# EAGLE schematic Main Board (EAGLE 9.6.2)
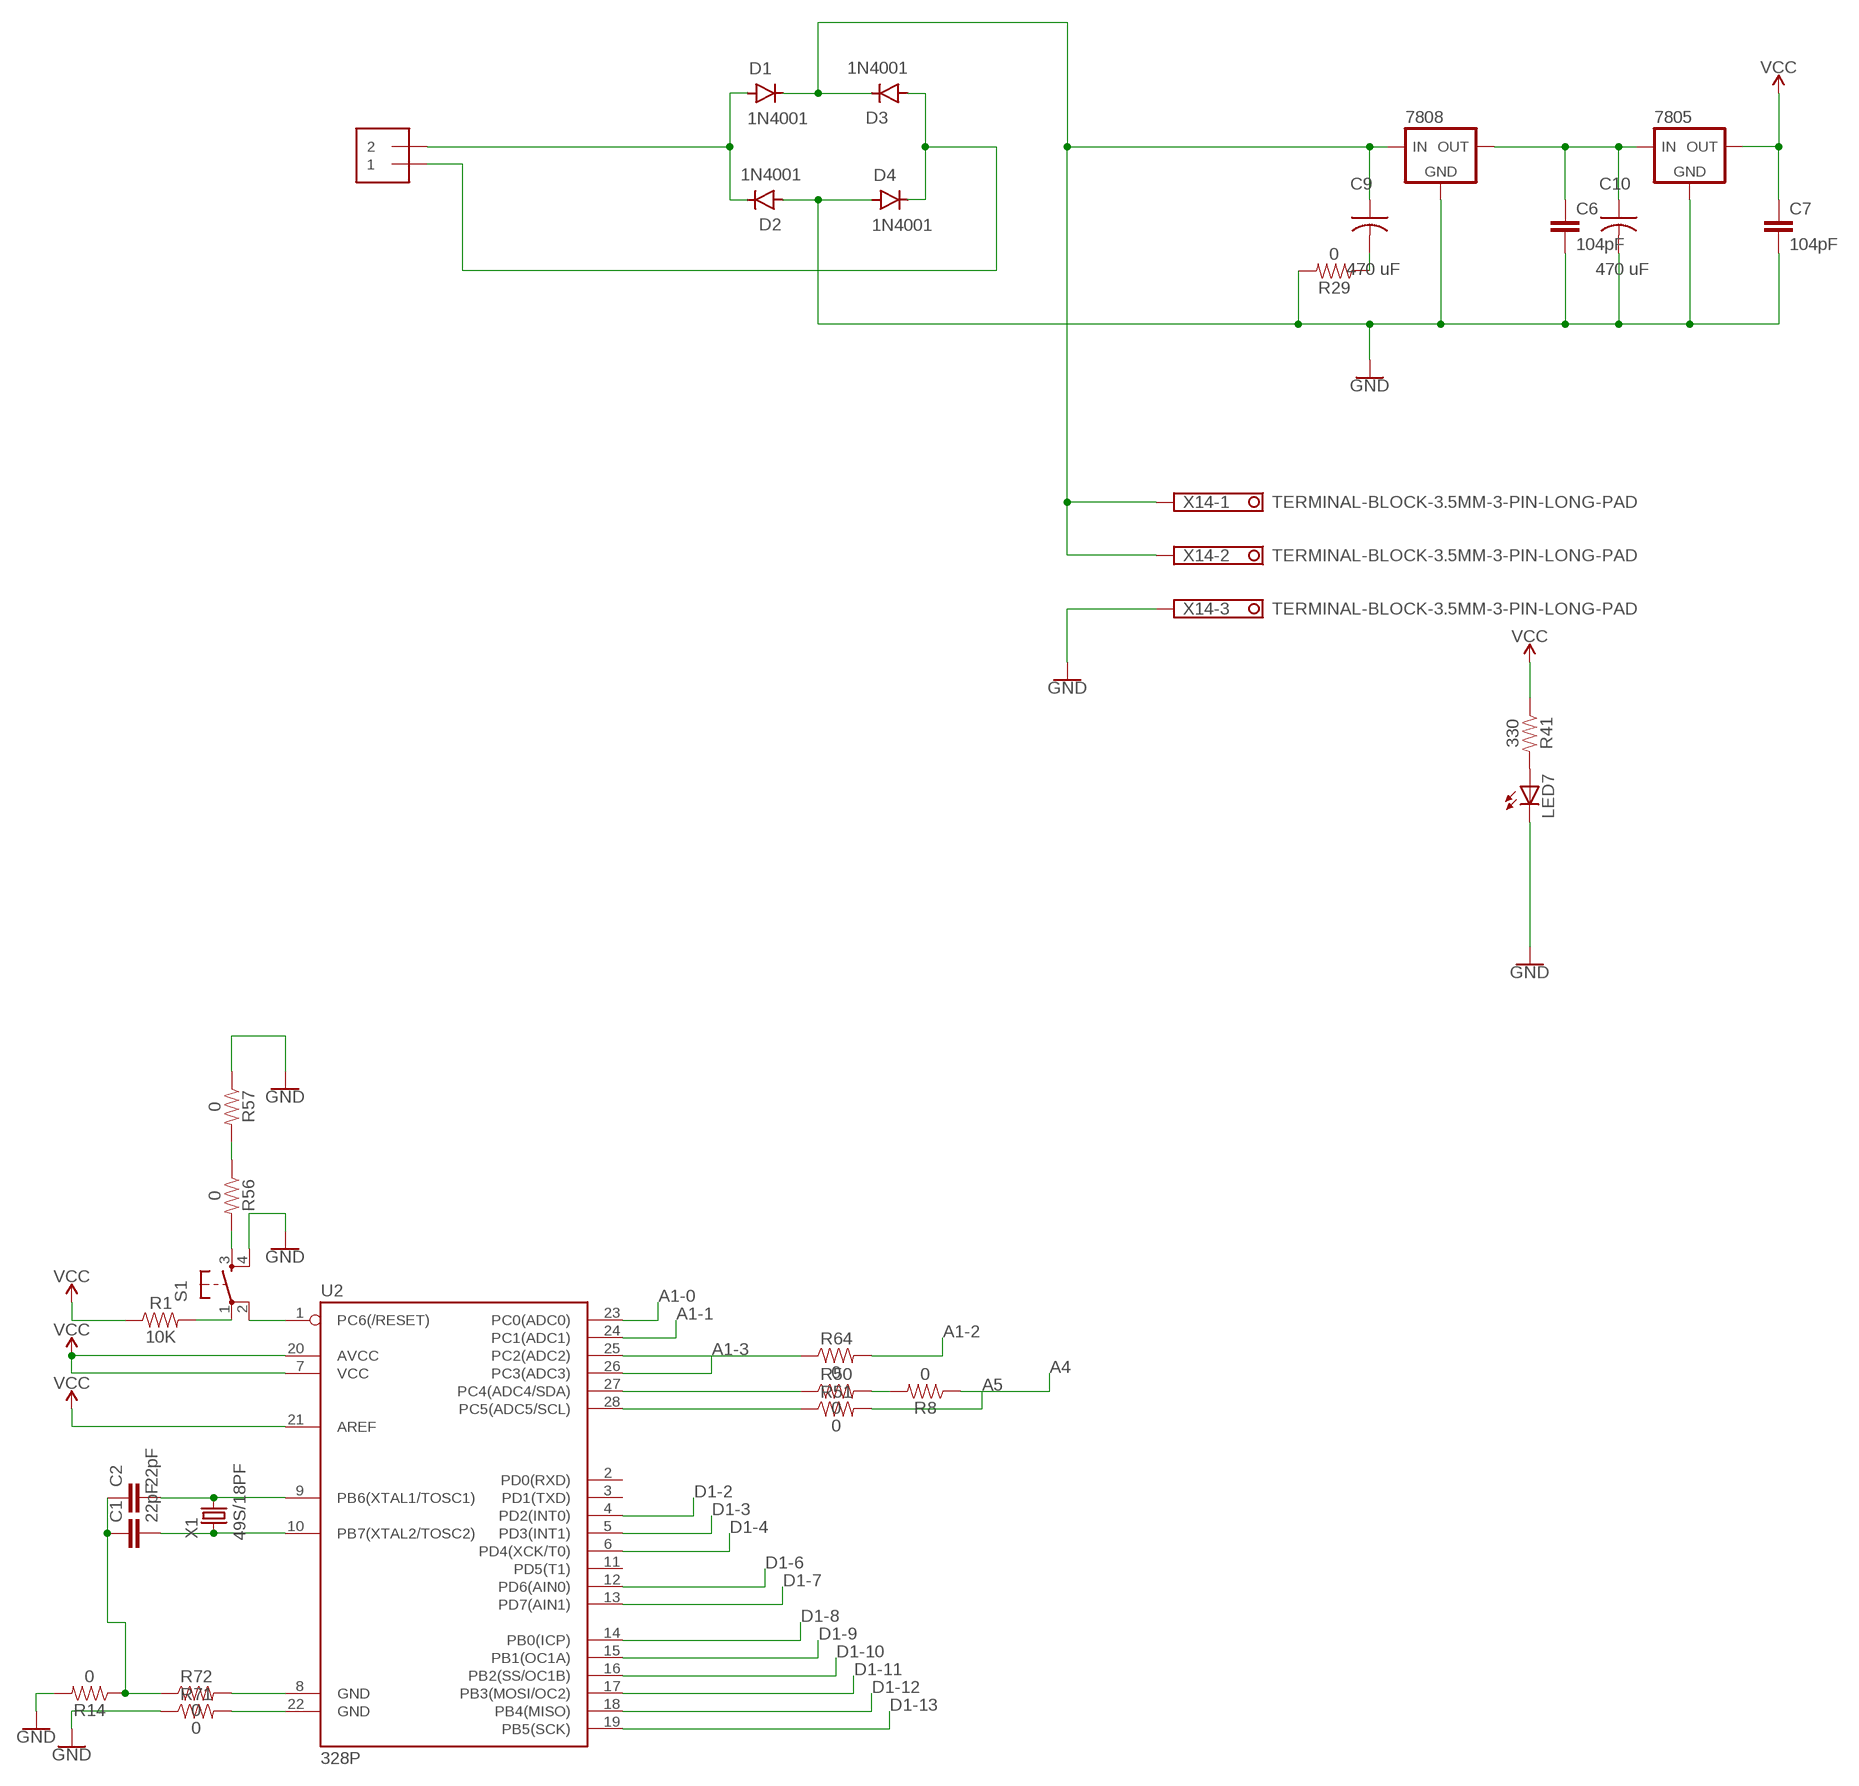
[diagram p0: schematic, sheet 1, part 1 of 3]
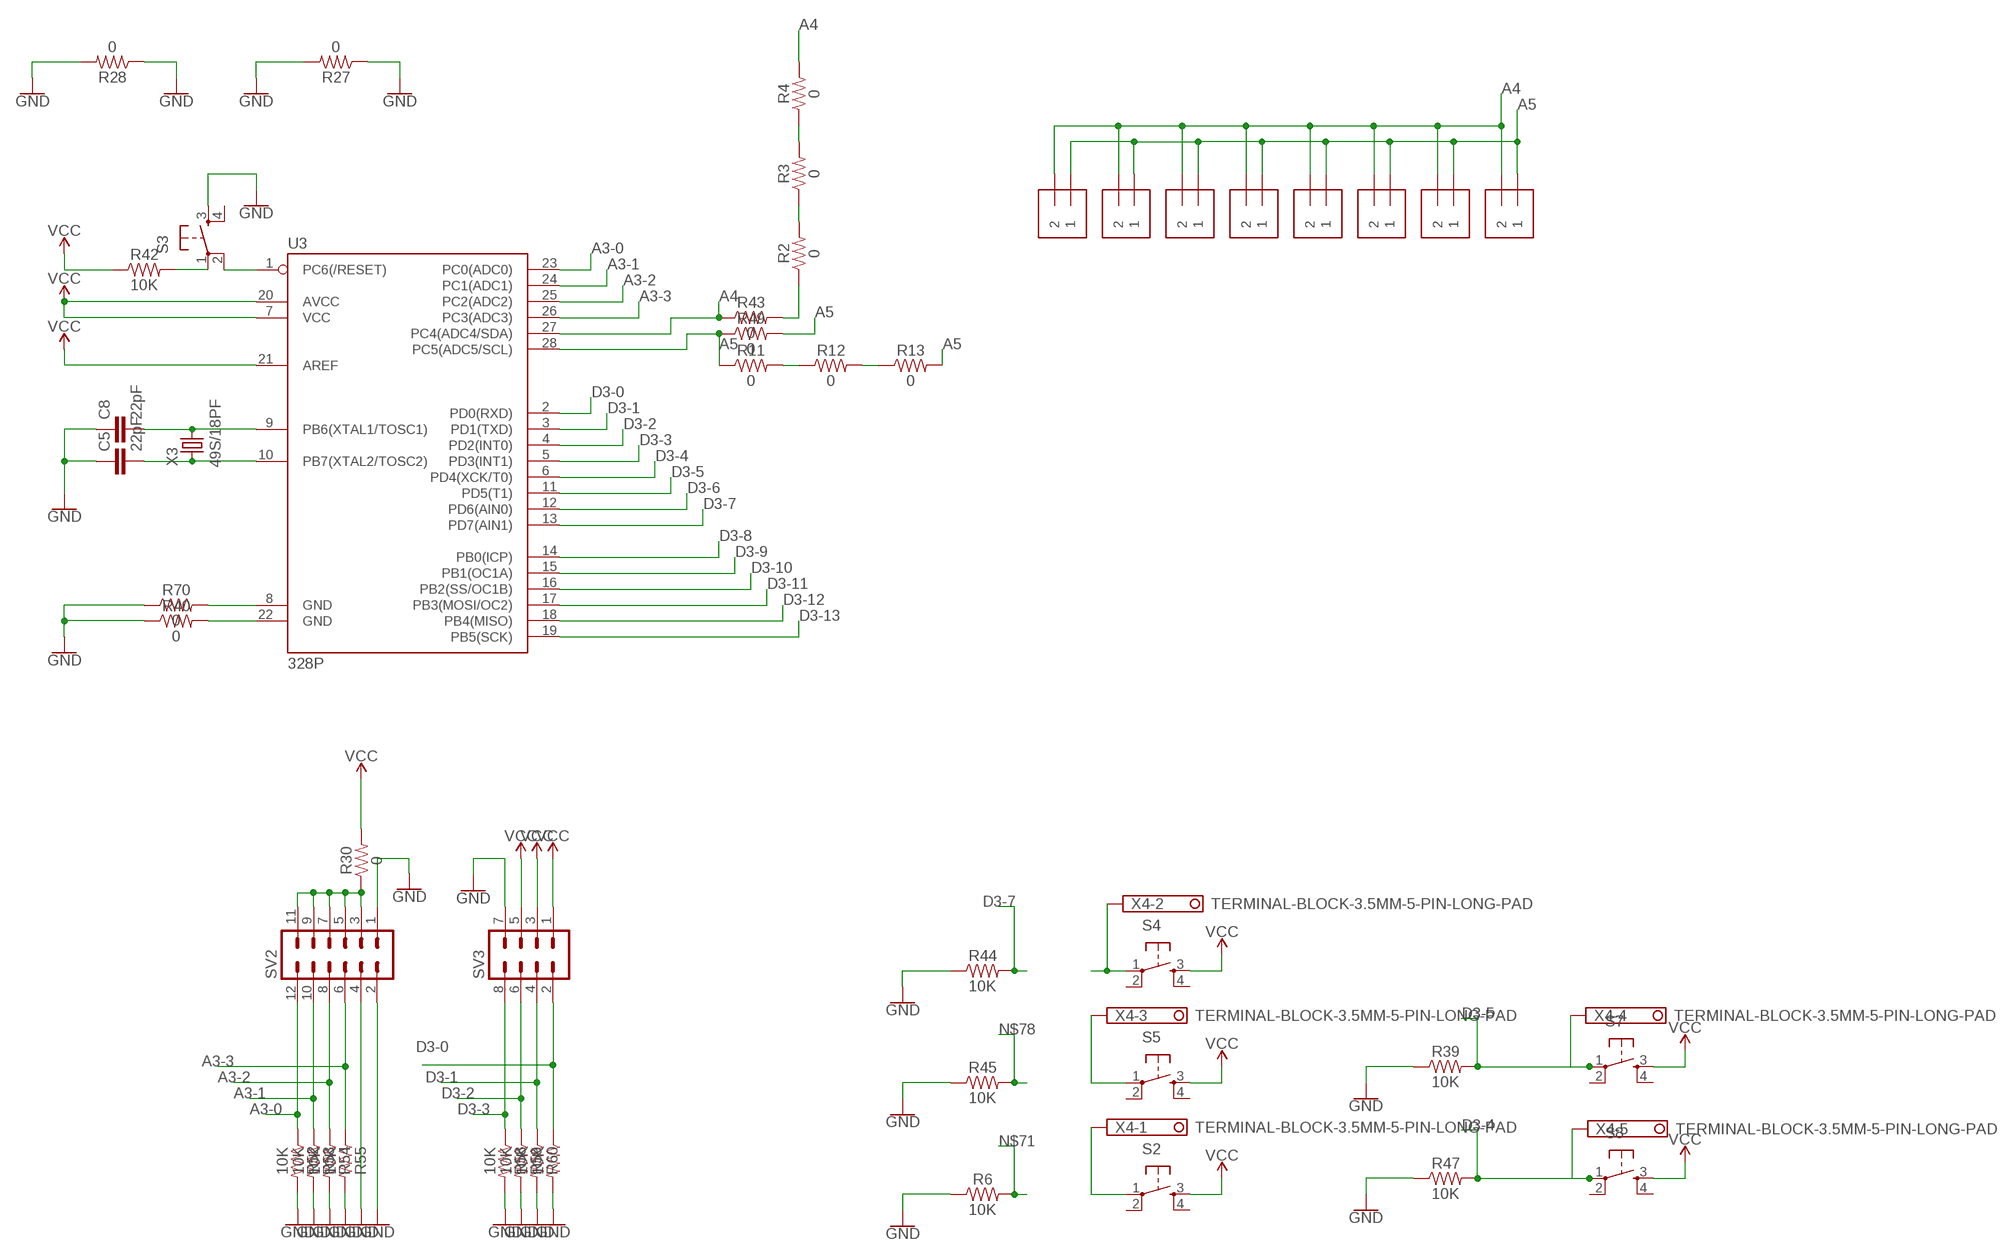
[diagram p1: schematic, sheet 1, part 2 of 3]
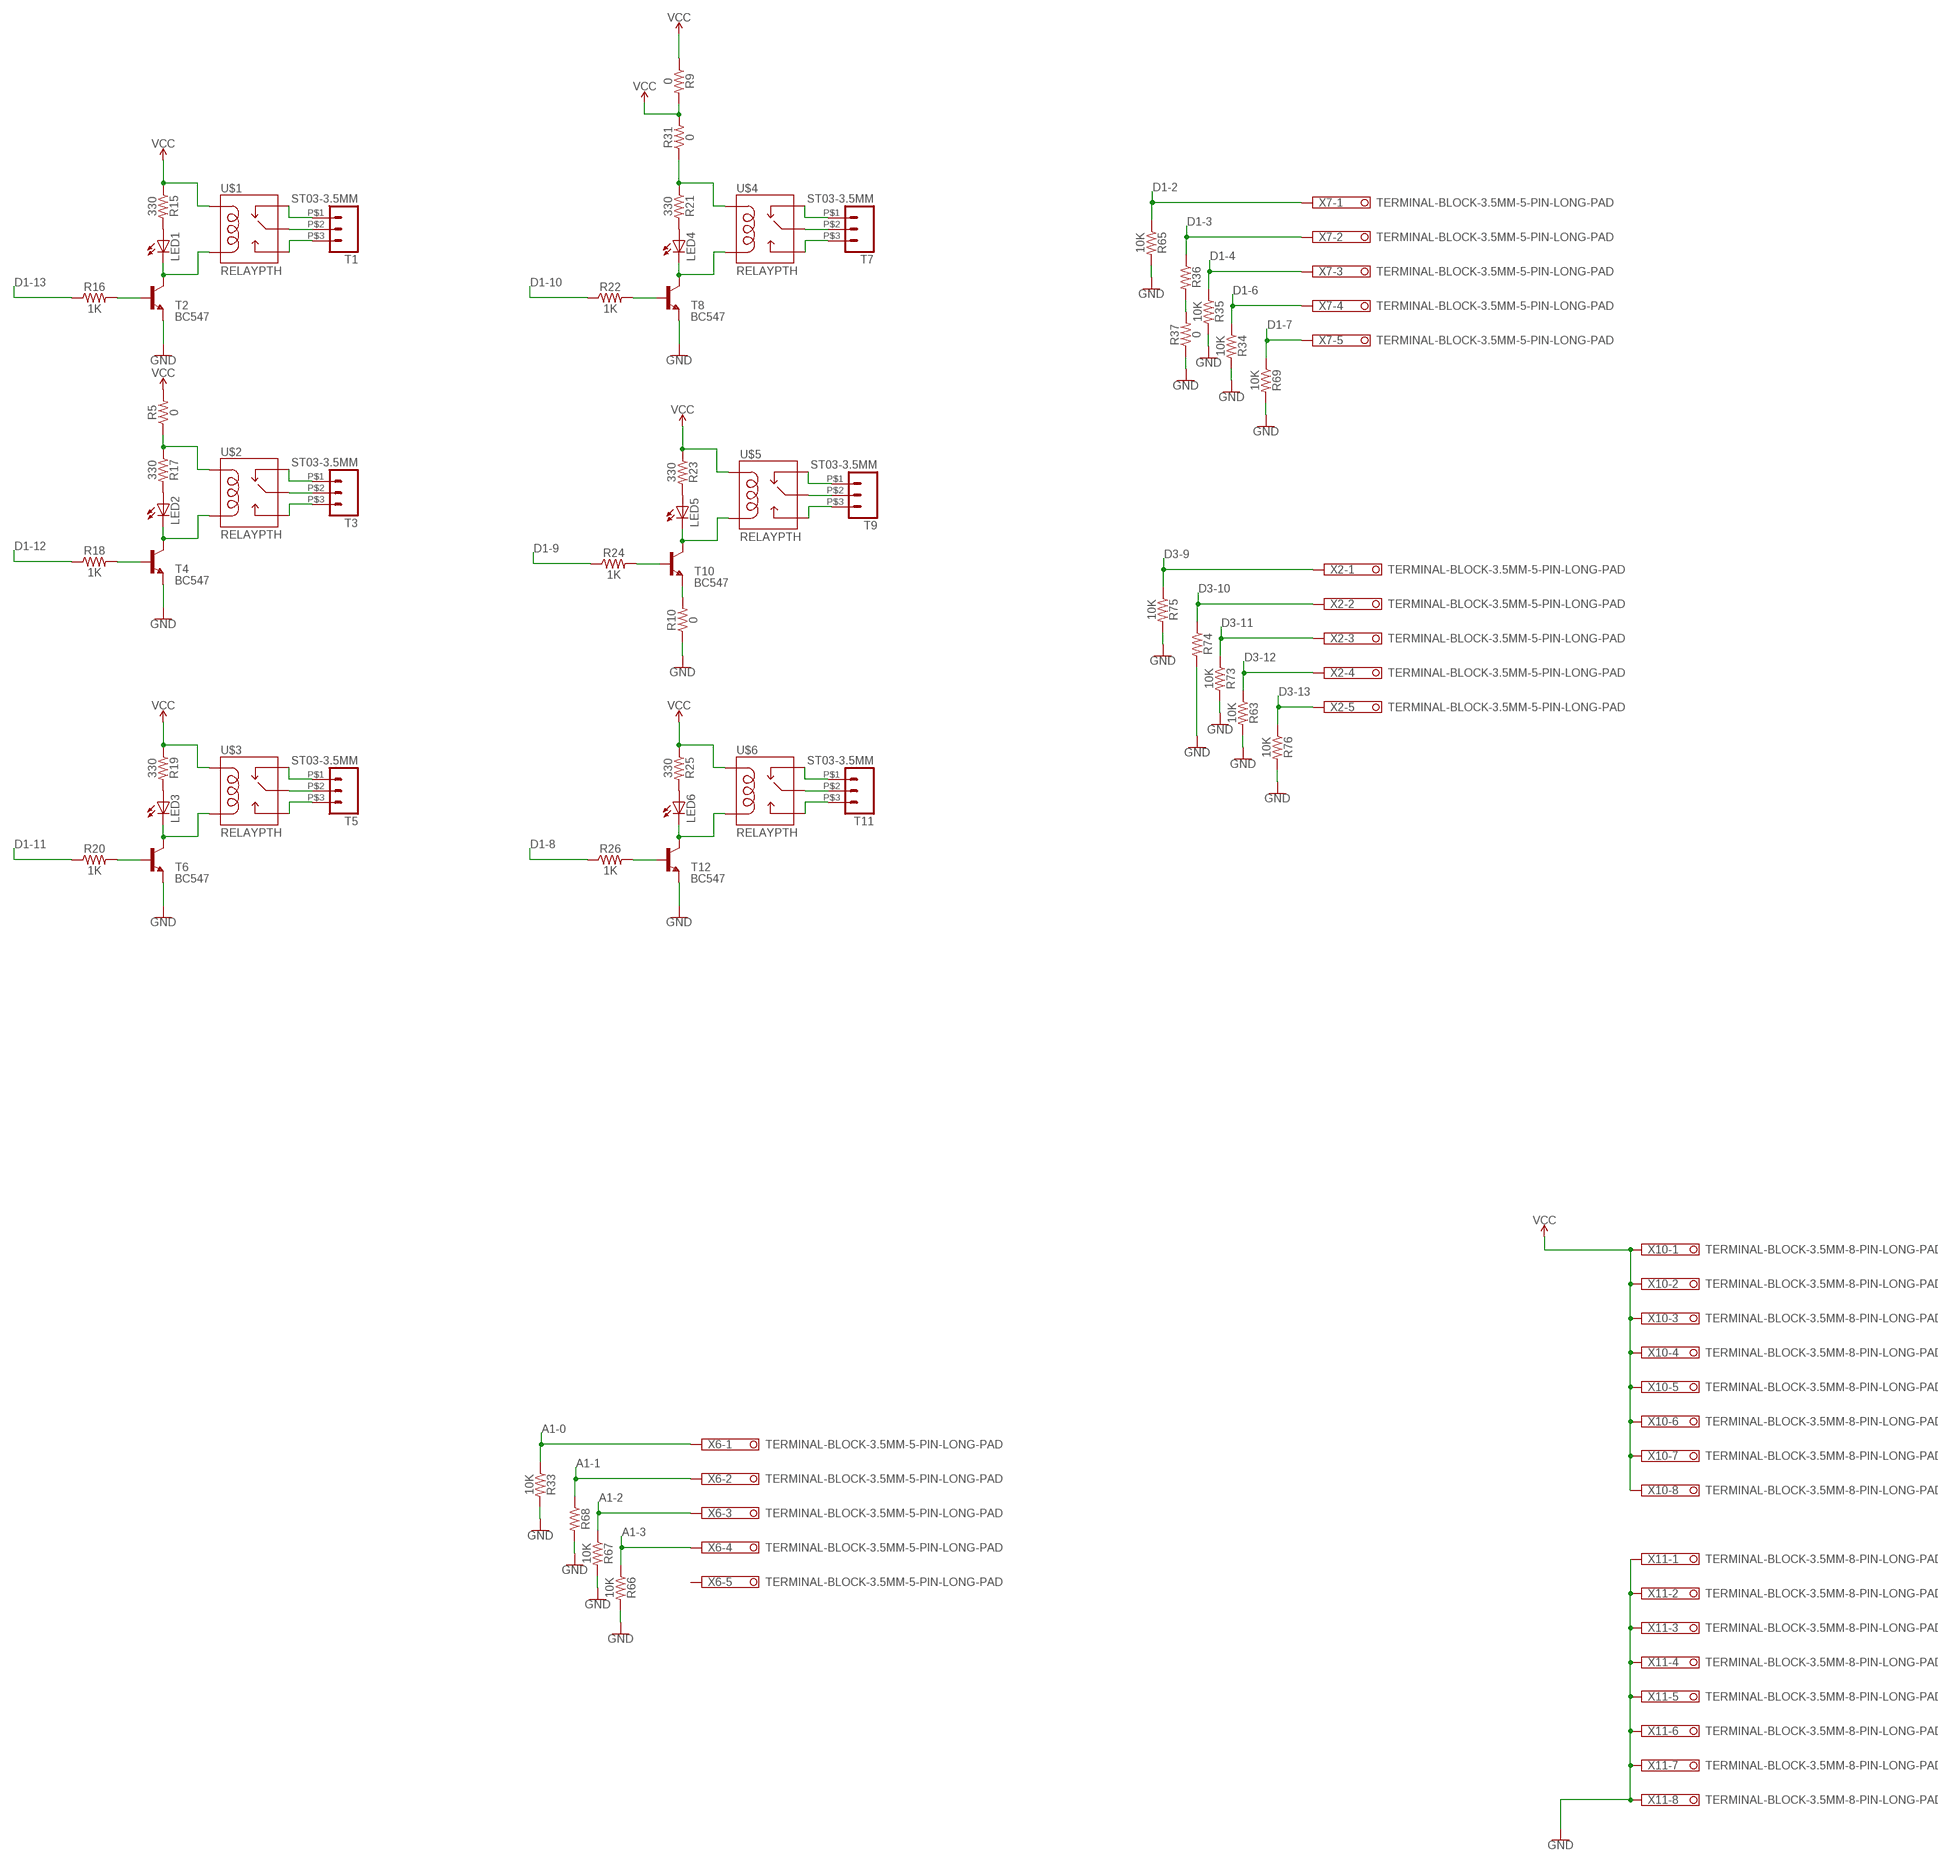
[diagram p2: schematic, sheet 1, part 3 of 3]

## Parts
7805  78XX-TO220H-NH  [TO220BH-NH]
7808  78XX-TO220H-NH  [TO220BH-NH]
C1  22pF  22PF-PTH-2.54MM-200V-5%  [CAP-PTH-2.54]
C2  22pF  22PF-PTH-2.54MM-200V-5%  [CAP-PTH-2.54]
C5  22pF  22PF-PTH-2.54MM-200V-5%  [CAP-PTH-2.54]
C6  104pF  22PF-PTH-2.54MM-200V-5%  [CAP-PTH-2.54]
C7  104pF  22PF-PTH-2.54MM-200V-5%  [CAP-PTH-2.54]
C8  22pF  22PF-PTH-2.54MM-200V-5%  [CAP-PTH-2.54]
C9  470 uF  ECA-1EM102  [CAP_RADIAL_5MM]
C10  470 uF  ECA-1EM102  [CAP_RADIAL_5MM]
D1  1N4001  1N4004  [DO-41]
D2  1N4001  1N4004  [DO-41]
D3  1N4001  1N4004  [DO-41]
D4  1N4001  1N4004  [DO-41]
LED1  LED5MM  [LED5MM]
LED2  LED5MM  [LED5MM]
LED3  LED5MM  [LED5MM]
LED4  LED5MM  [LED5MM]
LED5  LED5MM  [LED5MM]
LED6  LED5MM  [LED5MM]
LED7  LED5MM  [LED5MM]
POWER-INPUT  1X2-3.5MM  [1X2-3.5MM]
POWER-INPUT1  1X2-3.5MM  [1X2-3.5MM]
POWER-INPUT2  1X2-3.5MM  [1X2-3.5MM]
POWER-INPUT3  1X2-3.5MM  [1X2-3.5MM]
POWER-INPUT4  1X2-3.5MM  [1X2-3.5MM]
POWER-INPUT5  1X2-3.5MM  [1X2-3.5MM]
POWER-INPUT6  1X2-3.5MM  [1X2-3.5MM]
POWER-INPUT7  1X2-3.5MM  [1X2-3.5MM]
POWER-INPUT8  1X2-3.5MM  [1X2-3.5MM]
R1  10K  10MOHM-HORIZ-1/4W-5%  [AXIAL-0.3]
R2  0  10MOHM-HORIZ-1/4W-5%  [AXIAL-0.3]
R3  0  10MOHM-HORIZ-1/4W-5%  [AXIAL-0.3]
R4  0  10MOHM-HORIZ-1/4W-5%  [AXIAL-0.3]
R5  0  10MOHM-HORIZ-1/4W-5%  [AXIAL-0.3]
R6  10K  10MOHM-HORIZ-1/4W-5%  [AXIAL-0.3]
R8  0  10MOHM-HORIZ-1/4W-5%  [AXIAL-0.3]
R9  0  10MOHM-HORIZ-1/4W-5%  [AXIAL-0.3]
R10  0  10MOHM-HORIZ-1/4W-5%  [AXIAL-0.3]
R11  0  10MOHM-HORIZ-1/4W-5%  [AXIAL-0.3]
R12  0  10MOHM-HORIZ-1/4W-5%  [AXIAL-0.3]
R13  0  10MOHM-HORIZ-1/4W-5%  [AXIAL-0.3]
R14  0  10MOHM-HORIZ-1/4W-5%  [AXIAL-0.3]
R15  330  10MOHM-HORIZ-1/4W-5%  [AXIAL-0.3]
R16  1K  10MOHM-HORIZ-1/4W-5%  [AXIAL-0.3]
R17  330  10MOHM-HORIZ-1/4W-5%  [AXIAL-0.3]
R18  1K  10MOHM-HORIZ-1/4W-5%  [AXIAL-0.3]
R19  330  10MOHM-HORIZ-1/4W-5%  [AXIAL-0.3]
R20  1K  10MOHM-HORIZ-1/4W-5%  [AXIAL-0.3]
R21  330  10MOHM-HORIZ-1/4W-5%  [AXIAL-0.3]
R22  1K  10MOHM-HORIZ-1/4W-5%  [AXIAL-0.3]
R23  330  10MOHM-HORIZ-1/4W-5%  [AXIAL-0.3]
R24  1K  10MOHM-HORIZ-1/4W-5%  [AXIAL-0.3]
R25  330  10MOHM-HORIZ-1/4W-5%  [AXIAL-0.3]
R26  1K  10MOHM-HORIZ-1/4W-5%  [AXIAL-0.3]
R27  0  10MOHM-HORIZ-1/4W-5%  [AXIAL-0.3]
R28  0  10MOHM-HORIZ-1/4W-5%  [AXIAL-0.3]
R29  0  10MOHM-HORIZ-1/4W-5%  [AXIAL-0.3]
R30  0  10MOHM-HORIZ-1/4W-5%  [AXIAL-0.3]
R31  0  10MOHM-HORIZ-1/4W-5%  [AXIAL-0.3]
R33  10K  10MOHM-HORIZ-1/4W-5%  [AXIAL-0.3]
R34  10K  10MOHM-HORIZ-1/4W-5%  [AXIAL-0.3]
R35  10K  10MOHM-HORIZ-1/4W-5%  [AXIAL-0.3]
R36  10K  10MOHM-HORIZ-1/4W-5%  [AXIAL-0.3]
R37  0  10MOHM-HORIZ-1/4W-5%  [AXIAL-0.3]
R39  10K  10MOHM-HORIZ-1/4W-5%  [AXIAL-0.3]
R40  0  10MOHM-HORIZ-1/4W-5%  [AXIAL-0.3]
R41  330  10MOHM-HORIZ-1/4W-5%  [AXIAL-0.3]
R42  10K  10MOHM-HORIZ-1/4W-5%  [AXIAL-0.3]
R43  0  10MOHM-HORIZ-1/4W-5%  [AXIAL-0.3]
R44  10K  10MOHM-HORIZ-1/4W-5%  [AXIAL-0.3]
R45  10K  10MOHM-HORIZ-1/4W-5%  [AXIAL-0.3]
R47  10K  10MOHM-HORIZ-1/4W-5%  [AXIAL-0.3]
R49  0  10MOHM-HORIZ-1/4W-5%  [AXIAL-0.3]
R50  0  10MOHM-HORIZ-1/4W-5%  [AXIAL-0.3]
R51  0  10MOHM-HORIZ-1/4W-5%  [AXIAL-0.3]
R52  10K  10MOHM-HORIZ-1/4W-5%  [AXIAL-0.3]
R53  10K  10MOHM-HORIZ-1/4W-5%  [AXIAL-0.3]
R54  10K  10MOHM-HORIZ-1/4W-5%  [AXIAL-0.3]
R55  10K  10MOHM-HORIZ-1/4W-5%  [AXIAL-0.3]
R56  0  10MOHM-HORIZ-1/4W-5%  [AXIAL-0.3]
R57  0  10MOHM-HORIZ-1/4W-5%  [AXIAL-0.3]
R58  10K  10MOHM-HORIZ-1/4W-5%  [AXIAL-0.3]
R59  10K  10MOHM-HORIZ-1/4W-5%  [AXIAL-0.3]
R60  10K  10MOHM-HORIZ-1/4W-5%  [AXIAL-0.3]
R61  10K  10MOHM-HORIZ-1/4W-5%  [AXIAL-0.3]
R63  10K  10MOHM-HORIZ-1/4W-5%  [AXIAL-0.3]
R64  0  10MOHM-HORIZ-1/4W-5%  [AXIAL-0.3]
R65  10K  10MOHM-HORIZ-1/4W-5%  [AXIAL-0.3]
R66  10K  10MOHM-HORIZ-1/4W-5%  [AXIAL-0.3]
R67  10K  10MOHM-HORIZ-1/4W-5%  [AXIAL-0.3]
R68  10K  10MOHM-HORIZ-1/4W-5%  [AXIAL-0.3]
R69  10K  10MOHM-HORIZ-1/4W-5%  [AXIAL-0.3]
R70  0  10MOHM-HORIZ-1/4W-5%  [AXIAL-0.3]
R71  0  10MOHM-HORIZ-1/4W-5%  [AXIAL-0.3]
R72  0  10MOHM-HORIZ-1/4W-5%  [AXIAL-0.3]
R73  10K  10MOHM-HORIZ-1/4W-5%  [AXIAL-0.3]
R74  10K  10MOHM-HORIZ-1/4W-5%  [AXIAL-0.3]
R75  10K  10MOHM-HORIZ-1/4W-5%  [AXIAL-0.3]
R76  10K  10MOHM-HORIZ-1/4W-5%  [AXIAL-0.3]
S1  TAC_SWITCHPTH  [TACTILE-PTH]
S2  TAC_SWITCHPTH  [TACTILE-PTH]
S3  TAC_SWITCHPTH  [TACTILE-PTH]
S4  TAC_SWITCHPTH  [TACTILE-PTH]
S5  TAC_SWITCHPTH  [TACTILE-PTH]
S7  TAC_SWITCHPTH  [TACTILE-PTH]
S8  TAC_SWITCHPTH  [TACTILE-PTH]
SV2  MA06-2  [MA06-2]
SV3  MA04-2  [MA04-2]
T1  ST03-3.5MM  [ED350V-03P]
T2  BC547  [TO92]
T3  ST03-3.5MM  [ED350V-03P]
T4  BC547  [TO92]
T5  ST03-3.5MM  [ED350V-03P]
T6  BC547  [TO92]
T7  ST03-3.5MM  [ED350V-03P]
T8  BC547  [TO92]
T9  ST03-3.5MM  [ED350V-03P]
T10  BC547  [TO92]
T11  ST03-3.5MM  [ED350V-03P]
T12  BC547  [TO92]
U2  328P  ATMEGA328P_PDIP  [DIP28]
U3  328P  ATMEGA328P_PDIP  [DIP28]
U$1  RELAYPTH  [SRD-05VDC-SL-C]
U$2  RELAYPTH  [SRD-05VDC-SL-C]
U$3  RELAYPTH  [SRD-05VDC-SL-C]
U$4  RELAYPTH  [SRD-05VDC-SL-C]
U$5  RELAYPTH  [SRD-05VDC-SL-C]
U$6  RELAYPTH  [SRD-05VDC-SL-C]
X1  49S/18PF  [XTAL_HC49]
X2  TERMINAL-BLOCK-3.5MM-5-PIN-LONG-PAD  [TERMINAL-BLOCK-5-PIN-3.5MM-LONG-PAD]
X3  49S/18PF  [XTAL_HC49]
X4  TERMINAL-BLOCK-3.5MM-5-PIN-LONG-PAD  [TERMINAL-BLOCK-5-PIN-3.5MM-LONG-PAD]
X6  TERMINAL-BLOCK-3.5MM-5-PIN-LONG-PAD  [TERMINAL-BLOCK-5-PIN-3.5MM-LONG-PAD]
X7  TERMINAL-BLOCK-3.5MM-5-PIN-LONG-PAD  [TERMINAL-BLOCK-5-PIN-3.5MM-LONG-PAD]
X10  TERMINAL-BLOCK-3.5MM-8-PIN-LONG-PAD  [TERMINAL-BLOCK-8-PIN-3.5MM-LONG-PAD]
X11  TERMINAL-BLOCK-3.5MM-8-PIN-LONG-PAD  [TERMINAL-BLOCK-8-PIN-3.5MM-LONG-PAD]
X14  TERMINAL-BLOCK-3.5MM-3-PIN-LONG-PAD  [TERMINAL-BLOCK-3-PIN-3.5MM-LONG-PAD]

## Nets
A1-0: R33.P$1 U2.23(PC0(ADC0)) X6.1
A1-1: R68.P$1 U2.24(PC1(ADC1)) X6.2
A1-2: R64.P$2 R67.P$1 X6.3
A1-3: R66.P$1 U2.26(PC3(ADC3)) X6.4
A3-0: R52.P$1 SV2.12 U3.23(PC0(ADC0))
A3-1: R53.P$1 SV2.10 U3.24(PC1(ADC1))
A3-2: R54.P$1 SV2.8 U3.25(PC2(ADC2))
A3-3: R55.P$1 SV2.6 U3.26(PC3(ADC3))
A4: POWER-INPUT1.2 POWER-INPUT2.2 POWER-INPUT3.2 POWER-INPUT4.2 POWER-INPUT5.2 POWER-INPUT6.2 POWER-INPUT7.2 POWER-INPUT8.2 R4.P$2 R8.P$1 R43.P$1 U3.27(PC4(ADC4/SDA))
A5: POWER-INPUT1.1 POWER-INPUT2.1 POWER-INPUT3.1 POWER-INPUT4.1 POWER-INPUT5.1 POWER-INPUT6.1 POWER-INPUT7.1 POWER-INPUT8.1 R11.P$1 R13.P$2 R49.P$1 R49.P$2 R51.P$2 U3.28(PC5(ADC5/SCL))
D1-2: R65.P$1 U2.4(PD2(INT0)) X7.1
D1-3: R36.P$1 U2.5(PD3(INT1)) X7.2
D1-4: R35.P$1 U2.6(PD4(XCK/T0)) X7.3
D1-6: R34.P$1 U2.12(PD6(AIN0)) X7.4
D1-7: R69.P$1 U2.13(PD7(AIN1)) X7.5
D1-8: R26.P$1 U2.14(PB0(ICP))
D1-9: R24.P$1 U2.15(PB1(OC1A))
D1-10: R22.P$1 U2.16(PB2(SS/OC1B))
D1-11: R20.P$1 U2.17(PB3(MOSI/OC2))
D1-12: R18.P$1 U2.18(PB4(MISO))
D1-13: R16.P$1 U2.19(PB5(SCK))
D3-0: R61.P$1 SV3.2 U3.2(PD0(RXD))
D3-1: R60.P$1 SV3.4 U3.3(PD1(TXD))
D3-2: R59.P$1 SV3.6 U3.4(PD2(INT0))
D3-3: R58.P$1 SV3.8 U3.5(PD3(INT1))
D3-4: R47.P$2 S8.1 U3.6(PD4(XCK/T0)) X4.5
D3-5: R39.P$2 S7.1 U3.11(PD5(T1)) X4.4
D3-6: S5.1 U3.12(PD6(AIN0)) X4.3
D3-7: R44.P$2 U3.13(PD7(AIN1))
D3-8: S2.1 U3.14(PB0(ICP)) X4.1
D3-9: R75.P$1 U3.15(PB1(OC1A)) X2.1
D3-10: R74.P$1 U3.16(PB2(SS/OC1B)) X2.2
D3-11: R73.P$1 U3.17(PB3(MOSI/OC2)) X2.3
D3-12: R63.P$1 U3.18(PB4(MISO)) X2.4
D3-13: R76.P$1 U3.19(PB5(SCK)) X2.5
GND: 7805.2(GND) 7808.2(GND) C5.1 C6.2 C7.2 C8.1 C10.2 D2.A D4.A LED7.K(C) R6.P$1 R10.P$1 R14.P$2 R27.P$1 R27.P$2 R28.P$1 R28.P$2 R29.P$2 R33.P$2 R34.P$2 R35.P$2 R37.P$1 R39.P$1 R40.P$1 R44.P$1 R45.P$1 R47.P$1 R52.P$2 R53.P$2 R54.P$2 R55.P$2 R57.P$1 R58.P$2 R59.P$2 R60.P$2 R61.P$2 R63.P$2 R65.P$2 R66.P$2 R67.P$2 R68.P$2 R69.P$2 R70.P$1 R71.P$1 R73.P$2 R74.P$2 R75.P$2 R76.P$2 S1.4 S3.3 SV2.1 SV2.2 SV2.4 SV3.7 T2.1(E) T4.1(E) T6.1(E) T8.1(E) T12.1(E) X11.1 X11.2 X11.3 X11.4 X11.5 X11.6 X11.7 X11.8 X14.3
N$1: C2.2 U2.9(PB6(XTAL1/TOSC1)) X1.2
N$2: C1.2 U2.10(PB7(XTAL2/TOSC2)) X1.1
N$3: R1.P$2 S1.1
N$4: S1.2 U2.1(PC6(/RESET))
N$5: R2.P$1 R43.P$2
N$6: R2.P$2 R3.P$1
N$7: R3.P$2 R4.P$1
N$8: R5.P$1 R17.P$1 U$2.COIL1
N$9: LED1.A R15.P$2
N$10: LED1.K(C) T2.3(C) U$1.COIL0
N$11: R16.P$2 T2.2(B)
N$12: T1.P$2 U$1.SWCOMMON
N$13: T1.P$1 U$1.SWCLOSED(SWCLOSE)
N$14: T1.P$3 U$1.SWOPEN
N$15: LED2.A R17.P$2
N$16: LED2.K(C) T4.3(C) U$2.COIL0
N$17: R18.P$2 T4.2(B)
N$18: T3.P$2 U$2.SWCOMMON
N$19: T3.P$1 U$2.SWCLOSED(SWCLOSE)
N$20: T3.P$3 U$2.SWOPEN
N$21: LED3.A R19.P$2
N$22: LED3.K(C) T6.3(C) U$3.COIL0
N$23: R20.P$2 T6.2(B)
N$24: T5.P$2 U$3.SWCOMMON
N$25: T5.P$1 U$3.SWCLOSED(SWCLOSE)
N$26: T5.P$3 U$3.SWOPEN
N$27: LED4.A R21.P$2
N$28: LED4.K(C) T8.3(C) U$4.COIL0
N$29: R22.P$2 T8.2(B)
N$30: T7.P$2 U$4.SWCOMMON
N$31: T7.P$1 U$4.SWCLOSED(SWCLOSE)
N$32: T7.P$3 U$4.SWOPEN
N$33: LED5.A R23.P$2
N$34: LED5.K(C) T10.3(C) U$5.COIL0
N$35: R24.P$2 T10.2(B)
N$36: T9.P$2 U$5.SWCOMMON
N$37: T9.P$1 U$5.SWCLOSED(SWCLOSE)
N$38: T9.P$3 U$5.SWOPEN
N$39: LED6.A R25.P$2
N$40: LED6.K(C) T12.3(C) U$6.COIL0
N$41: R26.P$2 T12.2(B)
N$42: T11.P$2 U$6.SWCOMMON
N$43: T11.P$1 U$6.SWCLOSED(SWCLOSE)
N$44: T11.P$3 U$6.SWOPEN
N$45: 7808.1(VIN) C9.1 D1.C D3.C X14.1 X14.2
N$46: LED7.A R41.P$2
N$47: D3.A D4.C POWER-INPUT.1
N$48: D1.A D2.C POWER-INPUT.2
N$49: C8.2 U3.9(PB6(XTAL1/TOSC1)) X3.2
N$50: 7805.1(VIN) 7808.3(VOUT) C6.1 C10.1
N$51: C5.2 U3.10(PB7(XTAL2/TOSC2)) X3.1
N$52: R42.P$2 S3.1
N$53: S3.2 U3.1(PC6(/RESET))
N$54: C9.2 R29.P$1
N$55: C1.1 C2.1 R14.P$1 R72.P$1
N$56: R11.P$2 R12.P$1
N$57: R50.P$1 U2.27(PC4(ADC4/SDA))
N$58: R51.P$1 U2.28(PC5(ADC5/SCL))
N$61: R64.P$1 U2.25(PC2(ADC2))
N$62: R10.P$2 T10.1(E)
N$63: R12.P$2 R13.P$1
N$67: R40.P$2 U3.22(GND)
N$68: R70.P$2 U3.8(GND)
N$69: R71.P$2 U2.22(GND)
N$70: R72.P$2 U2.8(GND)
N$71: R6.P$2
N$72: R8.P$2 R50.P$2
N$73: R30.P$1 SV2.3 SV2.5 SV2.7 SV2.9 SV2.11
N$74: R21.P$1 R31.P$1 U$4.COIL1
N$75: R36.P$2 R37.P$2
N$76: R56.P$2 S1.3
N$77: R56.P$1 R57.P$2
N$78: R45.P$2
N$79: S4.1 X4.2
VCC: 7805.3(VOUT) C7.1 R1.P$1 R5.P$2 R9.P$1 R9.P$2 R15.P$1 R19.P$1 R23.P$1 R25.P$1 R30.P$2 R31.P$2 R41.P$1 R42.P$1 S2.3 S4.3 S5.3 S7.3 S8.3 SV3.1 SV3.3 SV3.5 U2.7(VCC) U2.20(AVCC) U2.21(AREF) U3.7(VCC) U3.20(AVCC) U3.21(AREF) U$1.COIL1 U$3.COIL1 U$5.COIL1 U$6.COIL1 X10.1 X10.2 X10.3 X10.4 X10.5 X10.6 X10.7 X10.8
Unconnected: S2.2 S2.4 S3.4 S4.2 S4.4 S5.2 S5.4 S7.2 S7.4 S8.2 S8.4 U2.2(PD0(RXD)) U2.3(PD1(TXD)) U2.11(PD5(T1)) X6.5

## Library data of the parts
7805 7808 = bt_regulator:78XX: 78XX Linear Voltage Regulator The venerable 7800-series Linear Voltage Regulator, including 7805, 7809, 7812, 7815, 7862 in 5 V, 6.2 V, 8.2 V, 9 V, 12 V, and 15 V, respectively Datasheets TI_LM78L05.pdf <http://www.ti.com/lit/ds/symlink/lm78l05.pdf> Fairchild_LM7805.pdf <https://www.fairchildsemi.com/datasheets/LM/LM7805.pdf>
C1 C2 C5 C8 = SparkFun-Capacitors:22PF: 22pF ceramic capacitors A capacitor is a passive two-terminal electrical component used to store electrical energy temporarily in an electric field.; PROD_ID: CAP-09128
C6 C7 = SparkFun-Capacitors:22PF: 22pF ceramic capacitors A capacitor is a passive two-terminal electrical component used to store electrical energy temporarily in an electric field.; PROD_ID: CAP-09128; VALUE: 22pF
C9 C10 = Resistor_Capacitor:ECA-1EM102: CAP ALUM 1000UF 20% 25V RADIAL Manufacturer's datasheet <https://media.digikey.com/pdf/Data%20Sheets/Panasonic%20Electronic%20Components/ECA-xxM%20Series,TypeA.pdf>; CREATED_BY: PCBLayout.com; DIGIKEY_PART_NUMBER: P5156-ND; MANUFACTURER: Panasonic Electronic Components; MPN: ECA-1EM102; PACKAGE: CAP RADIAL 5MM LS
D1-D4 = Diodes:1N4004: DIODE GEN PURP 400V 1A DO41 Manufacturer's datasheet <https://www.mccsemi.com/pdf/Products/1N4001-1N4007(DO-41).pdf>; CREATED_BY: PCBLayout.com; DIGIKEY_PART_NUMBER: 1N4004MSCT-ND; MANUFACTURER: Micro Commercial Co; MPN: 1N4004; PACKAGE: DO-41
LED1-LED7 = adafruit:LED: LED OSRAM: - CHIPLED LG R971, LG N971, LY N971, LG Q971, LY Q971, LO R971, LY R971 LH N974, LH R974 LS Q976, LO Q976, LY Q976 LO Q996 - Hyper CHIPLED LW Q18S LB Q993, LB Q99A, LB R99A - SideLED LS A670, LO A670, LY A670, LG A670, LP A670 LB A673, LV A673, LT A673, LW A673 LH A674 LY A675 LS A676, LA A676, LO A676, LY A676, LW A676 LS A679, LY A679, LG A679 - Hyper Micro SIDELED® LS Y876, LA Y876, LO Y876, LY Y876 LT Y87S - SmartLED LW L88C, LW L88S LB L89C, LB L89S, LG L890 LS L89K, LO L89K, LY L89K LS L896, LA L896, LO L896, LY L896 - TOPLED LS T670, LO T670, LY T670, LG T670, LP T670 LSG T670, LSP T670, LSY T670, LOP T670, LYG T670 LG T671, LOG T671, LSG T671 LB T673, LV T673, LT T673, LW T673 LH T674 LS T676, LA T676, LO T676, LY T676, LB T676, LH T676, LSB T676, LW T676 LB T67C, LV T67C, LT T67C, LS T67K, LO T67K, LY T67K, LW E67C LS E67B, LA E67B, LO E67B, LY E67B, LB E67C, LV E67C, LT E67C LW T67C LS T679, LY T679, LG T679 LS T770, LO T770, LY T770, LG T770, LP T770 LB T773, LV T773, LT T773, LW T773 LH T774 LS E675, LA E675, LY E675, LS T675 LS T776, LA T776, LO T776, LY T776, LB T776 LHGB T686 LT T68C, LB T68C - Hyper Mini TOPLED® LB M676 - Mini TOPLED Santana® LG M470 LS M47K, LO M47K, LY M47K Source: http://www.osram.convergy.de/
POWER-INPUT POWER-INPUT1-POWER-INPUT8 = adafruit:1X2: 3.5mm Terminal block http://www.ladyada.net/library/pcb/eaglelibrary.html
R1-R6 R8-R31 R33-R37 R39-R45 R47 R49-R61 R63-R76 = SparkFun-Resistors:10MOHM: RES-09327; PROD_ID: RES-09327; VALUE: 10M
S1-S5 S7 S8 = SparkFun:TAC_SWITCH: Momentary Switch Button commonly used for reset or general input. Spark Fun Electronics SKU : COM-00097
SV2 = con-lstb:MA06-2: PIN HEADER; OC_FARNELL: unknown; OC_NEWARK: unknown
SV3 = con-lstb:MA04-2: PIN HEADER; OC_FARNELL: unknown; OC_NEWARK: unknown
T1 T3 T5 T7 T9 T11 = con-dinkle:ST03: Dinkle® Screw Terminal Block - 3 Way -5MM: EK500V series. Rated at 20A, 300VAC. Cable size: 2mm² Supplier: Altronics P2035A Source: http://www.dinkle.com/upfiles/proter21253708953.pdf -3.5MM: ED350V series. Rated at 10A, 300VAC. Cable size: 1.4mm² Supplier: Altronics P2029 Source: http://www.dinkle.com/upfiles/proter21253714491.pdf
T2 T4 T6 T8 T10 T12 = transistor:BC547: NPN TRANSISTOR
U2 U3 = SparkFun-IC-Microcontroller:ATMEGA328P_PDIP: Atmel 328P Through hole ATMEGA328P uC used in the Arduino 32kb flash, 1k EEPROM, 2k SRAM Datasheet <http://www.sparkfun.com/datasheets/Components/SMD/ATMega328.pdf> SparkFun Products Storefront component: AVR 28 Pin 20MHz 32K 6A/D - ATMega328P <https://www.sparkfun.com/products/9061> (COM-09061) SparkFun Simon Says - Through-Hole Soldering Kit <https://www.sparkfun.com/products/10547> (KIT-10547) SparkFun Learn to Solder - Simon Says <https://www.sparkfun.com/products/13708> (KIT-13708) SparkFun BigTime Watch Kit <https://www.sparkfun.com/products/11734> (KIT-11734) SparkFun ClockIt <https://www.sparkfun.com/products/10930> (KIT-10930) SparkFun Serial Enabled LCD Kit <https://www.sparkfun.com/products/10097> (LCD-10097) SparkFun Simon Tilts - Through Hole Soldering Kit <https://www.sparkfun.com/products/12634> (KIT-12634) SparkFun Frequency Counter Kit <https://www.sparkfun.com/products/10140> (KIT-10140) FabFM Radio Kit <https://www.sparkfun.com/products/11043> (KIT-11043) SparkFun Binary Blaster Kit <https://www.sparkfun.com/products/12037> (KIT-12037) SparkFun Metro-Gnome <https://www.sparkfun.com/products/9236> (KIT-09236) ATmega328 with Arduino Optiboot (Uno) <https://www.sparkfun.com/products/10524> (DEV-10524); PROD_ID: IC-09136
U$1-U$6 = SRD-05VDC-SL-C:RELAY: SPDT relay (COM-00101)
X1 X3 = Crystals_Oscillators:49S/18PF: Crystal Manufacturer's datasheet <https://datasheet.octopart.com/49S-18PF-Xinhunjing-datasheet-30677139.pdf>; CREATED_BY: PCBLayout.com; MANUFACTURER: Xinhunjing; MPN: 49S/18PF; PACKAGE: SMD
X2 X4 X6 X7 = Rembrandt Electronics - Terminal Block 3-5mm v1-0:TERMINAL-BLOCK-3.5MM-5-PIN: Terminal Block 3.5mm Pitch: 3,5 mm Number of pins: 5 Created by Rembrandt Electronics www.rembrandtelectronics.com
X10 X11 = Rembrandt Electronics - Terminal Block 3-5mm v1-0:TERMINAL-BLOCK-3.5MM-8-PIN: Terminal Block 3.5mm Pitch: 3,5 mm Number of pins: 8 Created by Rembrandt Electronics www.rembrandtelectronics.com
X14 = Rembrandt Electronics - Terminal Block 3-5mm v1-0:TERMINAL-BLOCK-3.5MM-3-PIN: Terminal Block 3.5mm Pitch: 3,5 mm Number of pins: 3 Created by Rembrandt Electronics www.rembrandtelectronics.com